# EAGLE design 5V_DC_DC (EAGLE 7.2.0)
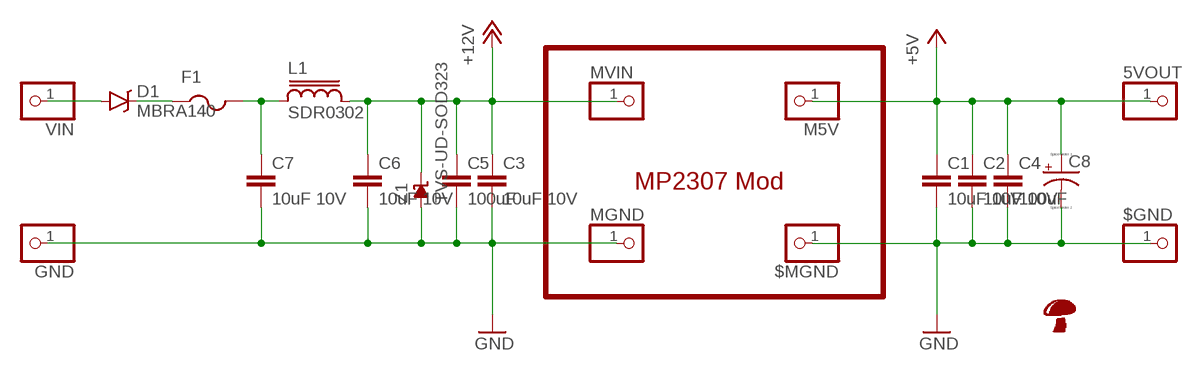
[diagram p0: schematic, sheet 1]

## Parts
5VOUT  PINHD-1X1  [1X01]
$GND  PINHD-1X1  [1X01]
$MGND  PINHD-1X1  [1X01]
C1  10uF 10V  C-EUC0805  [C0805]
C2  10uF 10V  C-EUC0805  [C0805]
C3  10uF 10V  C-EUC0805  [C0805]
C4  100uF  C-EUC1206  [C1206]
C5  100uF  C-EUC1206  [C1206]
C6  10uF 10V  C-EUC0805  [C0805]
C7  10uF 10V  C-EUC0805  [C0805]
C8  CPOL-USD  [PANASONIC_D]
D1  MBRA140  [SMA-DIODE]
F1  PTCFUSE-1812  [1812]
GND  PINHD-1X1  [1X01]
L1  SDR0302  [SDR0302]
M5V  PINHD-1X1  [1X01]
MGND  PINHD-1X1  [1X01]
MVIN  PINHD-1X1  [1X01]
U$1  SHROOM5MM  [SHROOM]
VIN  PINHD-1X1  [1X01]
Z1  TVS-UD-SOD323  [SOD323]

## Nets
+5V: 5VOUT.1 C1.1 C2.1 C4.1 C8.+ M5V.1
+12V: C3.1 C5.1 C6.1 L1.2 MVIN.1 Z1.C
GND: $GND.1 $MGND.1 C1.2 C2.2 C3.2 C4.2 C5.2 C6.2 C7.2 C8.- GND.1 MGND.1 Z1.A
N$2: C7.1 F1.2 L1.1
N$3: D1.C F1.1
N$4: D1.A VIN.1

## Notes on the sheet
- MP2307 Mod

## Library data of the parts
5VOUT $GND $MGND GND M5V MGND MVIN VIN = pinhead:PINHD-1X1: PIN HEADER
C1-C7 = resistor:C-EU: CAPACITOR, European symbol
C8 = resistor:CPOL-US: POLARIZED CAPACITOR, American symbol
D1 = SparkFun-DiscreteSemi:MBRA140: 40V, 1A Schottky rectifier SMA/DO-214AC package DIO-08053; PROD_ID: DIO-08053
F1 = adafruit:PTCFUSE: PTC fuses, resettable thermistors
L1 = inductor-bourns:SDR0302: POWER INDUCTOR
U$1 = RobThePyro:SHROOM
Z1 = supressor:TVS-UD-: TVS UNI-DIRECTIONAL

## Board
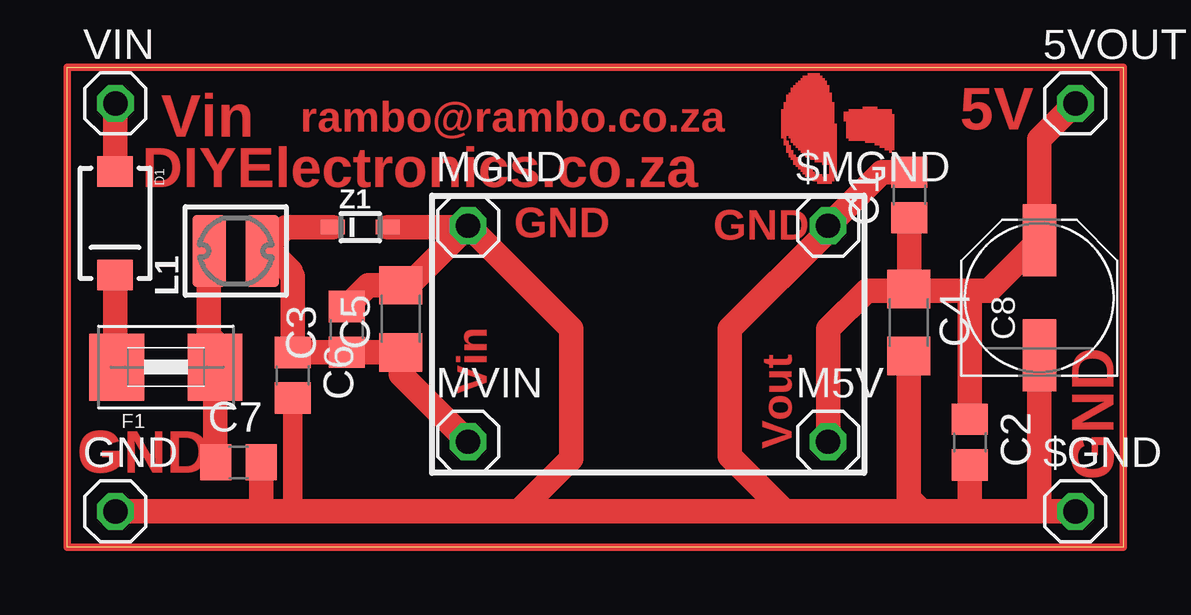
[diagram p1: board, top side]
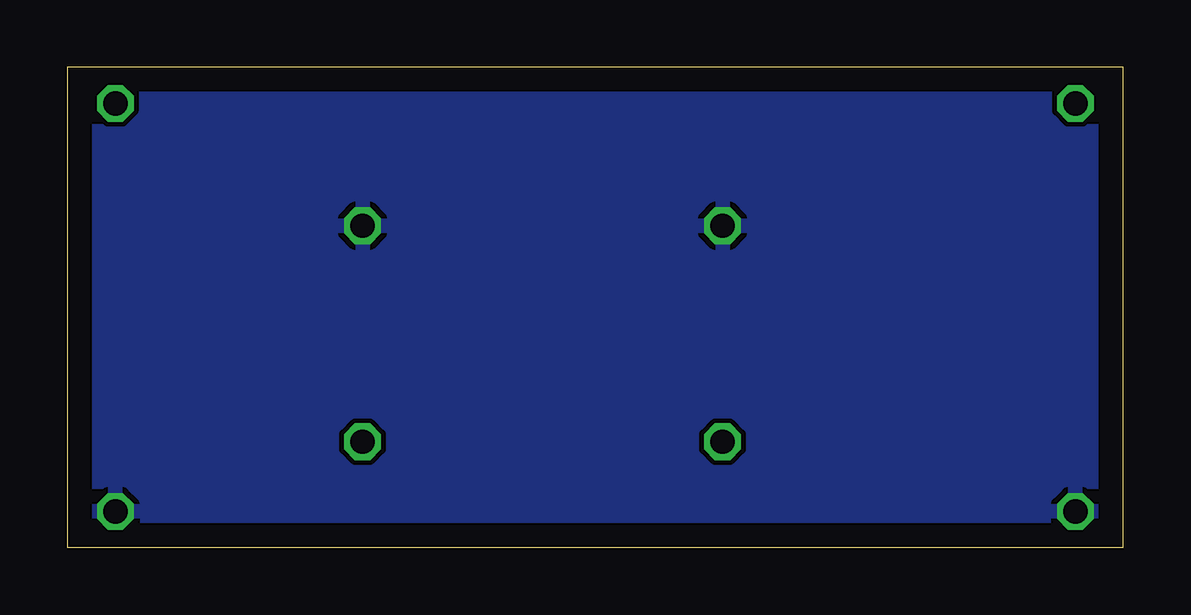
[diagram p2: board, bottom side, seen from below]

Size 44 x 20 mm. Coordinates in mm from the lower left corner, seen from the top.
Outline: 0,0 0,20 44,20 44,0 0,0
Copper layers (1*16): Top 0.035mm / dielectric 1.5mm / Bottom 0.035mm
Design rules "default": minimum track width 10mil, minimum drill 24mil, track to track 8mil, track to pad 8mil, pad to pad 8mil, via to via 8mil, smd to smd 8mil, copper to edge 40mil, drill to drill 8mil, minimum pad ring 10mil, minimum via ring 8mil, stop-mask expansion 4mil, vias tented up to drill 0mil, thermal gap 10mil

### Footprints (pad centres in the part's own frame; a part is rotated, then mirrored left to right if it is on the bottom)
1X01 = drill 1.016 octagon: 1 0,0
C0805 = smd 1.3 x 1.5: 1 -0.95,0; 2 0.95,0
C1206 = smd 1.6 x 1.8: 1 -1.4,0; 2 1.4,0
PANASONIC_D = smd 3 x 1.4: + 2.4,0; - -2.4,0
SMA-DIODE = smd 1.27 x 1.47: A -2.15,0; C 2.15,0
1812 = smd 2.286 x 2.794: 1 -2.046,0; 2 2.046,0
SDR0302 = smd 3 x 1.4: 1 0,1.1; 2 0,-1.1
SOD323 = smd 1 x 0.6: A 1.143,0; C -1.143,0

### Placement (x,y rotation side)
5VOUT  42,18.5 0 top
$GND  42,1.5 0 top
$MGND  31.7,13.4 0 top
C1  35.09,14.68 90 top
C2  37.61,4.38 270 top
C3  11.64,9.08 90 top
C4  35.06,9.37 270 top
C5  13.89,9.52 90 top
C6  9.39,7.17 270 top
C7  7.13,3.54 0 top
C8  40.5,10.4 90 top
D1  1.99,13.5 270 top
F1  4.11,7.51 0 top
GND  2,1.5 0 top
L1  7.02,12.35 90 top
M5V  31.7,4.4 0 top
MGND  16.7,13.4 0 top
MVIN  16.7,4.4 0 top
U$1  34.4,15.1 90 top
VIN  2,18.5 0 top
Z1  12.21,13.34 0 top

### Tracks (layer width: path | path; a pad name or v marks a point on that pad's centre or on a via)
+5V
  Top 1.016: M5V.1 31.7,9.1 33.3,10.7 34.99,10.7 | 34.99,10.7 C4.1 35.09,10.8 C1.1 | 34.99,10.7 37.8,10.7 | 37.8,10.7 38.4,10.7 C8.+ 40.5,17 5VOUT.1 | C2.1 37.61,10.51 37.8,10.7
+12V
  Top 1.016: C6.1 9.4,11.3 9.3,11.4 9.3,11.5 8.45,12.35 L1.2 9.11,13.34 Z1.C | C6.1 | C6.1 C3.1 C5.1 13.89,7.21 MVIN.1
GND
  Top 0.813: C6.2 9.39,1.59 9.3,1.5
  Top 1.016: GND.1 7.9,1.5 | 7.9,1.5 9.3,1.5 18.8,1.5 | 18.8,1.5 21,3.7 21,9.1 MGND.1 | C7.2 8.08,1.68 7.9,1.5 | Z1.A 16.64,13.34 MGND.1 | C3.2 12.53,10.92 C5.2 14.22,10.92 MGND.1 | $GND.1 40.4,1.5 | 40.4,1.5 37.8,1.5 | 37.8,1.5 35.6,1.5 | 35.6,1.5 29.9,1.5 | 29.9,1.5 18.8,1.5 | 29.9,1.5 27.6,3.8 27.6,9.1 31.7,13.2 $MGND.1 33.93,15.63 C1.2 | C2.2 37.61,1.69 37.8,1.5 | C4.2 35.06,2.04 35.6,1.5 | C8.- 40.5,1.6 40.4,1.5
  pour Bottom: 0,0 0,20 44,20 44,0
N$1
  Top 0.305: 0,0 0,20 44,20 44,0 0,0
N$2
  Top 1.016: L1.1 5.9,12.33 5.9,8.8 6.16,8.54 F1.2 6.16,3.56 C7.1
N$3
  Top 1.016: D1.C 1.99,7.58 F1.1
N$4
  Top 1.016: VIN.1 D1.A

### Text on the board
Top: Vin | rambo@rambo.co.za | 5V | DIYElectronics.co.za | GND | GND | Vin | Vout | GND | GND